# EasyEDA schematic HW1_17.json
TITLE: Sheet_1; REV: 1.0; Date: 2020-11-04; Sheet: 1/1; Drawn By: gokbeykeskin_4066; Company: Your Company
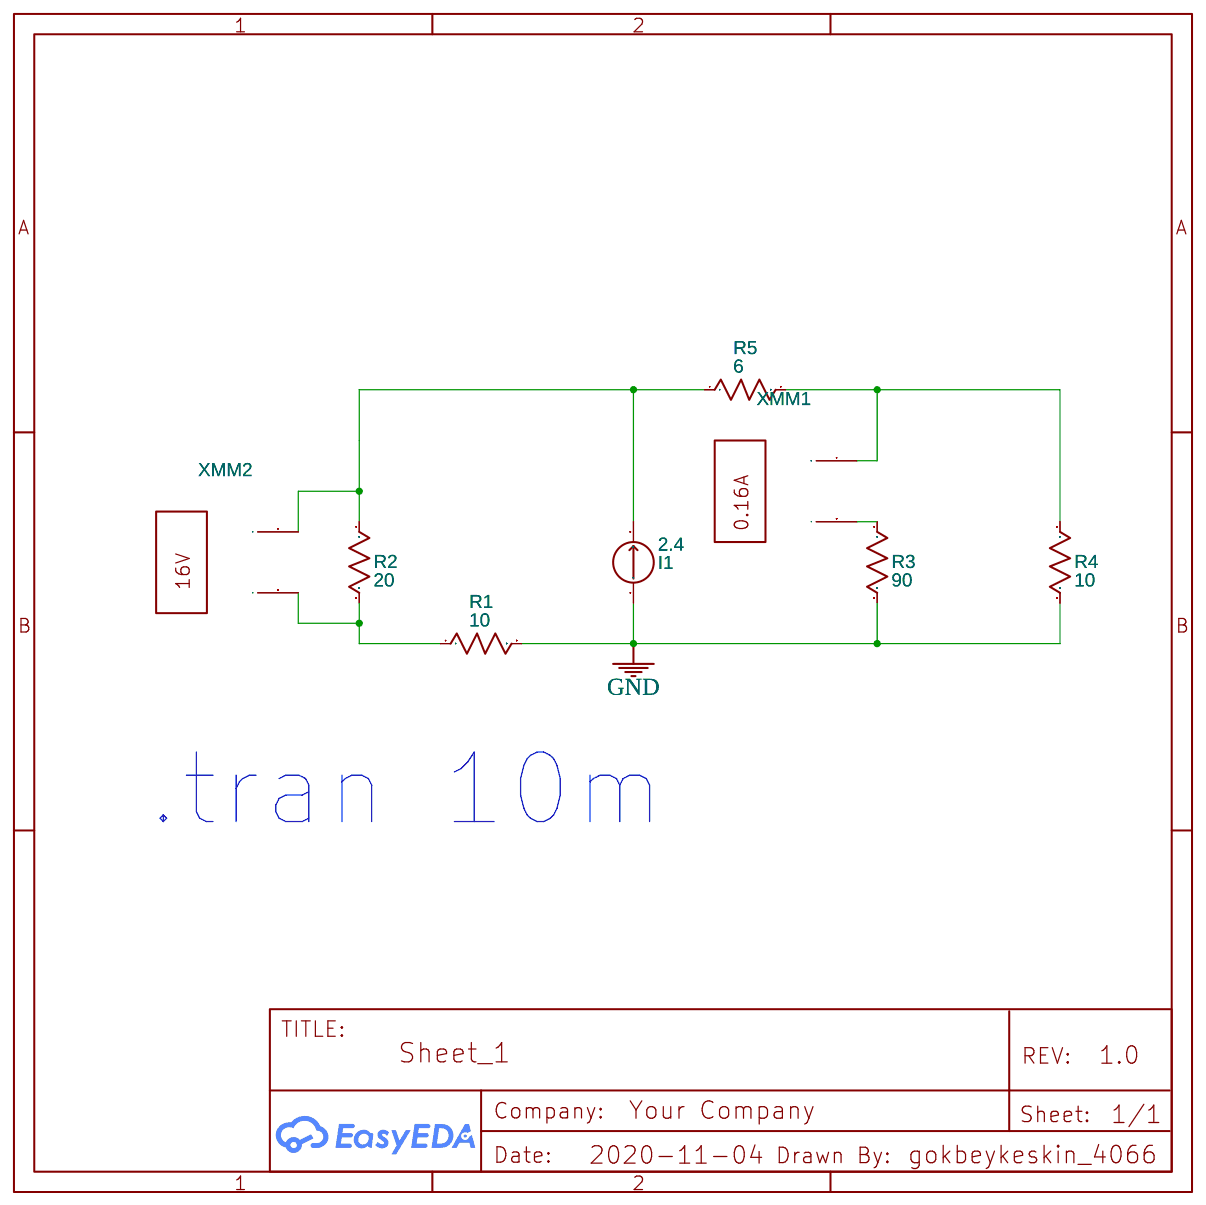
[diagram p0: schematic sheet]

## Parts
I1  2.4  [2P-5.08]
R1  10  [AXIAL-0.3]
R2  20  [AXIAL-0.3]
R3  90  [AXIAL-0.3]
R4  10  [AXIAL-0.3]
R5  6  [AXIAL-0.3]
XMM1  Multimeter
XMM2  Multimeter

## Library data of the parts
I1 = IDC: Contributor: EasyEDA; sim: true
R1-R5 = Resistor_US: Resistance: 1k; Contributor: EasyEDA; Supplier: YUJING
XMM1 = MULTIMETER: Supplier: LCSC; Multimeter Type: Amper; Power Type: AC; Voltmeter resistance: 10μ; Ammeter resistance: 1G; NameDisplay: 0; Contributor: EasyEDA; sim: true
XMM2 = MULTIMETER: Supplier: LCSC; Multimeter Type: Voltmeter; Power Type: AC; Voltmeter resistance: 10μ; Ammeter resistance: 1G; NameDisplay: 0; Contributor: EasyEDA; sim: true

## Nets
GND: I1.1 R1.2 R3.2 R4.2
Net-(I1-2): I1.2 R2.1 R5.1 XMM2.1(+)
Net-(R1-1): R1.1 R2.2 XMM2.2(I)
Net-(R3-1): R3.1 XMM1.2(I)
Net-(R4-1): R4.1 R5.2 XMM1.1(+)

## Notes on the sheet
- .tran 10m
